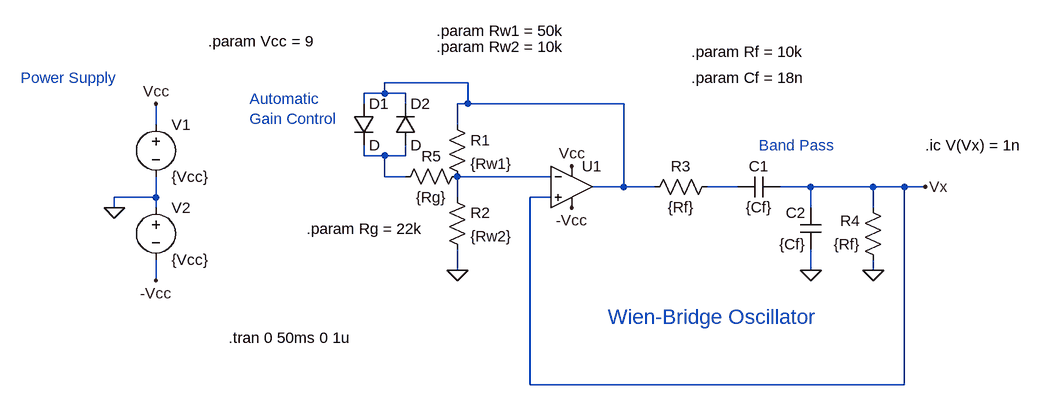
[diagram p0: schematic Music-Visualiser.asc]
Music-Visualiser.asc, the LTspice schematic file:
Version 4
SHEET 1 1132 704
WIRE 240 -176 112 -176
WIRE 112 -160 112 -176
WIRE 112 -160 80 -160
WIRE 144 -160 112 -160
WIRE 80 -144 80 -160
WIRE 144 -144 144 -160
WIRE 240 -144 240 -176
WIRE 240 -144 224 -144
WIRE 480 -144 240 -144
WIRE -240 -112 -240 -144
WIRE 224 -112 224 -144
WIRE 80 -64 80 -80
WIRE 112 -64 80 -64
WIRE 144 -64 144 -80
WIRE 144 -64 112 -64
WIRE 112 -32 112 -64
WIRE 144 -32 112 -32
WIRE 368 -32 224 -32
WIRE 480 -16 480 -144
WIRE 480 -16 432 -16
WIRE 528 -16 480 -16
WIRE 656 -16 608 -16
WIRE 768 -16 720 -16
WIRE 864 -16 768 -16
WIRE 912 -16 864 -16
WIRE 944 -16 912 -16
WIRE -240 0 -240 -32
WIRE -240 0 -304 0
WIRE 224 0 224 -32
WIRE 368 0 336 0
WIRE -304 16 -304 0
WIRE -240 16 -240 0
WIRE 768 16 768 -16
WIRE 864 16 864 -16
WIRE 224 112 224 80
WIRE 768 112 768 80
WIRE 864 112 864 96
WIRE -240 128 -240 96
WIRE 336 288 336 0
WIRE 912 288 912 -16
WIRE 912 288 336 288
FLAG 224 112 0
FLAG 944 -16 Vx
FLAG -304 16 0
FLAG -240 128 -Vcc
FLAG -240 -144 Vcc
FLAG 400 -48 Vcc
FLAG 400 16 -Vcc
FLAG 768 112 0
FLAG 864 112 0
SYMBOL res 624 -32 R90
WINDOW 0 0 56 VBottom 2
WINDOW 3 32 56 VTop 2
SYMATTR InstName R3
SYMATTR Value {Rf}
SYMBOL cap 720 -32 R90
WINDOW 0 0 32 VBottom 2
WINDOW 3 32 32 VTop 2
SYMATTR InstName C1
SYMATTR Value {Cf}
SYMBOL res 880 112 R180
WINDOW 0 36 76 Left 2
WINDOW 3 36 40 Left 2
SYMATTR InstName R4
SYMATTR Value {Rf}
SYMBOL cap 784 80 R180
WINDOW 0 24 56 Left 2
WINDOW 3 24 8 Left 2
SYMATTR InstName C2
SYMATTR Value {Cf}
SYMBOL res 208 -128 R0
SYMATTR InstName R1
SYMATTR Value {Rw1}
SYMBOL res 208 -16 R0
SYMATTR InstName R2
SYMATTR Value {Rw2}
SYMBOL voltage -240 -128 R0
WINDOW 123 0 0 Left 0
WINDOW 39 0 0 Left 0
SYMATTR InstName V1
SYMATTR Value {Vcc}
SYMBOL voltage -240 0 R0
WINDOW 123 0 0 Left 0
WINDOW 39 0 0 Left 0
SYMATTR InstName V2
SYMATTR Value {Vcc}
SYMBOL OpAmps\\UniversalOpAmp 400 -16 R0
SYMATTR InstName U1
SYMBOL diode 64 -144 R0
SYMATTR InstName D1
SYMBOL diode 128 -80 M180
WINDOW 0 24 64 Left 2
WINDOW 3 24 0 Left 2
SYMATTR InstName D2
SYMBOL res 240 -48 R90
WINDOW 0 0 56 VBottom 2
WINDOW 3 32 56 VTop 2
SYMATTR InstName R5
SYMATTR Value {Rg}
TEXT -128 216 Left 2 !.tran 0 50ms 0 1u
TEXT 584 -224 Left 2 !.param Rf = 10k
TEXT 584 -184 Left 2 !.param Cf = 18n
TEXT 192 -256 Left 2 !.param Rw1 = 50k
TEXT 192 -232 Left 2 !.param Rw2 = 10k
TEXT -160 -240 Left 2 !.param Vcc = 9
TEXT 944 -80 Left 2 !.ic V(Vx) = 1n
TEXT -8 48 Left 2 !.param Rg = 22k
TEXT -448 -184 Left 2 ;Power Supply
TEXT 688 -80 Left 2 ;Band Pass
TEXT -96 -152 Left 2 ;Automatic\nGain Control
TEXT 456 184 Left 3 ;Wien-Bridge Oscillator

The netlist it stands for:
* Music-Visualiser.asc
R3 N004 N001 {Rf}
C1 Vx N004 {Cf}
R4 0 Vx {Rf}
C2 0 Vx {Cf}
R1 N001 N003 {Rw1}
R2 N003 0 {Rw2}
V1 Vcc 0 {Vcc}
V2 0 -Vcc {Vcc}
XU1 Vx N003 Vcc -Vcc N001 level1 Avol=1Meg GBW=10Meg Vos=0 En=0 Enk=0 In=0 Ink=0 Rin=500Meg  ; pins In+ In- V+ V- OUT
D1 N001 N002 D
D2 N002 N001 D
R5 N003 N002 {Rg}
.model D D
.lib standard.dio
.tran 0 50ms 0 1u
.param Rf = 10k
.param Cf = 18n
.param Rw1 = 50k
.param Rw2 = 10k
.param Vcc = 9
.ic V(Vx) = 1n
.param Rg = 22k
* Power Supply
* Band Pass
* Automatic
* Gain Control
* Wien-Bridge Oscillator
.lib UniversalOpAmp1.lib
.backanno
.end